# Altium project voltage_current_measurement.PrjPcb
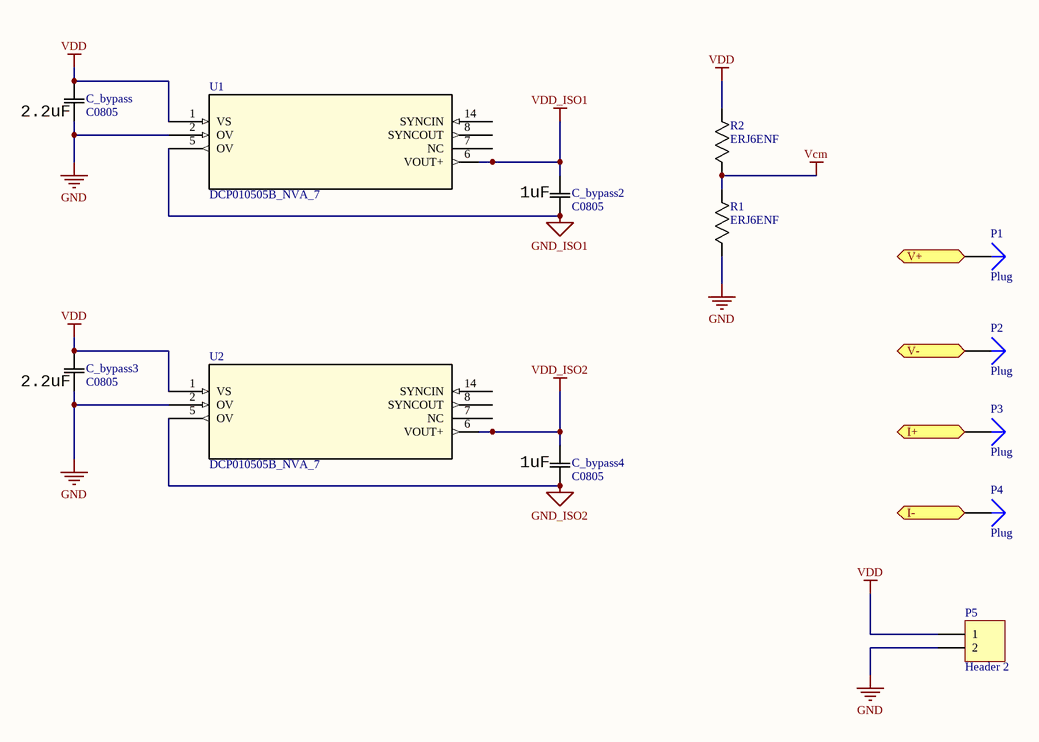
[diagram p0: Sheet1.SchDoc]
3 sheets, 36 parts. Net scope: flat (ports and power ports of the same name join across sheets).
Board file: PCB1.PcbDoc
Sheets:
  Sheet1.SchDoc
  Sheet2.SchDoc
  Sheet3.SchDoc

## Sheet Sheet1.SchDoc
size A4

### Parts
C_bypass  C0805  value 2.2uF  [C0805C]
C_bypass2  C0805  value 1uF  [C0805C]
C_bypass3  C0805  value 2.2uF  [C0805C]
C_bypass4  C0805  value 1uF  [C0805C]
P1  Plug  [PIN1]
P2  Plug  [PIN1]
P3  Plug  [PIN1]
P4  Plug  [PIN1]
P5  Header 2  [HDR1X2]
R1  ERJ6ENF  [0805]
R2  ERJ6ENF  [0805]
U1  DCP010505B_NVA_7  [NVA7]
U2  DCP010505B_NVA_7  [NVA7]

### Ports
I+ (bidir), I- (bidir), V+ (bidir), V- (bidir)

### Nets
GND: C_bypass.2 C_bypass3.2 P5.2 R1.1 U1.2(OV) U2.2(OV)
GND_ISO1: C_bypass2.2 U1.5(OV)
GND_ISO2: C_bypass4.2 U2.5(OV)
Vcm: R1.2 R2.1
VDD: C_bypass.1 C_bypass3.1 P5.1 R2.2 U1.1(VS) U2.1(VS)
VDD_ISO1: C_bypass2.1 U1.6(VOUT+)
VDD_ISO2: C_bypass4.1 U2.6(VOUT+)
NetC2_1: P4.1 ; port I-
NetP1_1: P1.1 ; port V+
NetP2_1: P2.1 ; port V-
NetP3_1: P3.1 ; port I+

Not connected (* = marked no-connect by the designer): U1 7(NC) 8(SYNCOUT) 14(SYNCIN); U2 7(NC) 8(SYNCOUT) 14(SYNCIN)

### Library data of the parts
C_bypass C_bypass2-C_bypass4 = C0805: Imported; Manufacturer_Part_Number: C0805C100C1GACTU; Vendor: Kemet; Built_By: EMA_UL_Team; C: Copyright (C) 2015 Accelerated Designs. All rights reserved; RefDes: RefDes; Type: DEV
P5 = Header 2: Header, 2-Pin; LatestRevisionDate: 17-Jul-2002; LatestRevisionNote: Re-released for DXP Platform.; Publisher: Altium Limited
R1 R2 = ERJ6ENF: Imported; Manufacturer_Part_Number: ERJ6ENF1000V; Vendor: Panasonic; Built_By: EMA_UL_Team; C: Copyright (C) 2016 Accelerated Designs. All rights reserved; RefDes: RefDes; Type: DEV; Value: Value
U1 U2 = DCP010505B_NVA_7: Imported; Manufacturer: Texas Instruments; Built_By: EMA_UL_Team; C: Copyright (C) 2015 Accelerated Designs. All rights reserved; Manufacturer_Part_Number: DCP010505B_NVA_7; Vendor: Texas Instruments; RefDes: RefDes; Type: DEV; Value: Value
P1-P4 = Plug: LatestRevisionDate: 17-Jul-2002; LatestRevisionNote: Re-released for DXP Platform.; Publisher: Altium Limited

## Sheet Sheet2.SchDoc
size A4
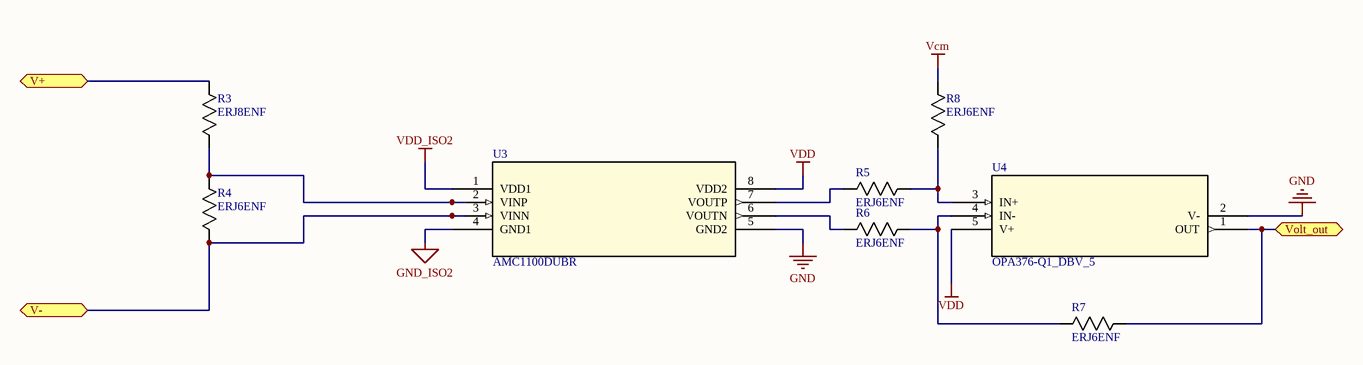
[diagram p1: Sheet2.SchDoc]

### Parts
R3  ERJ8ENF  [1206]
R4  ERJ6ENF  [0805]
R5  ERJ6ENF  [0805]
R6  ERJ6ENF  [0805]
R7  ERJ6ENF  [0805]
R8  ERJ6ENF  [0805]
U3  AMC1100DUBR  [DUB8]
U4  OPA376-Q1_DBV_5  [DBV5]

### Ports
V+ (bidir), V- (bidir), Volt_out (bidir)

### Nets
GND: U3.5(GND2) U4.2(V-)
GND_ISO2: U3.4(GND1)
Vcm: R8.2
VDD: U3.8(VDD2) U4.5(V+)
VDD_ISO2: U3.1(VDD1)
NetP1_1: R3.2 ; port V+
NetP2_1: R4.1 U3.3(VINN) ; port V-
NetR3_1: R3.1 R4.2 U3.2(VINP)
NetR5_1: R5.1 U3.7(VOUTP)
NetR5_2: R5.2 R8.1 U4.3(IN+)
NetR6_1: R6.1 U3.6(VOUTN)
NetR6_2: R6.2 R7.1 U4.4(IN-)
NetR7_2: R7.2 U4.1(OUT) ; port Volt_out

### Library data of the parts
R3 = ERJ8ENF: Imported; Manufacturer_Part_Number: ERJ8ENF1000V; Vendor: Panasonic; Built_By: EMA_UL_Team; C: Copyright (C) 2016 Accelerated Designs. All rights reserved; RefDes: RefDes; Type: DEV; Value: Value
R4-R8 = ERJ6ENF: as R1 on sheet Sheet1; RefDes: RefDes; Type: DEV; Value: Value
U3 = AMC1100DUBR: Imported; Vendor: Texas Instruments; Built_By: EMA_UL_Team; C: Copyright (C) 2015 Accelerated Designs. All rights reserved; Manufacturer_Part_Number: AMC1100DUBR; RefDes: RefDes; Type: DEV; Value: Value
U4 = OPA376-Q1_DBV_5: Imported; Manufacturer: Texas Instruments; Built_By: EMA_UL_Team; C: Copyright (C) 2015 Accelerated Designs. All rights reserved; Vendor: Texas Instruments; Manufacturer_Part_Number: OPA376-Q1_DBV_5; RefDes: RefDes; Type: DEV; Value: Value

## Sheet Sheet3.SchDoc
size A4
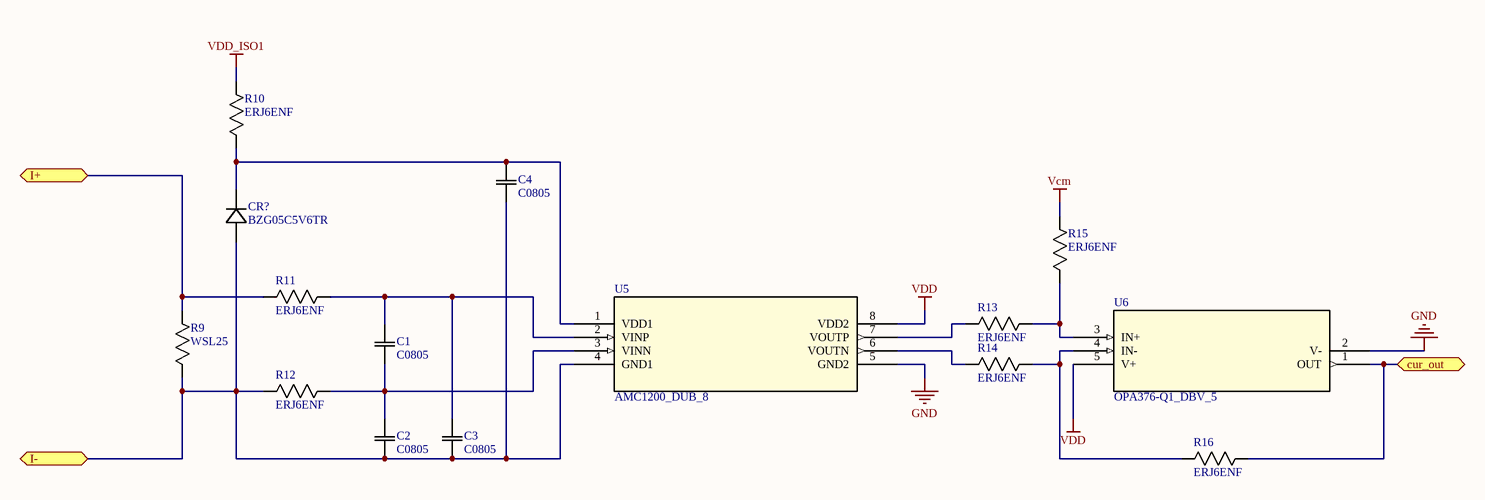
[diagram p2: Sheet3.SchDoc]

### Parts
C1  C0805  [C0805C]
C2  C0805  [C0805C]
C3  C0805  [C0805C]
C4  C0805  [C0805C]
CR?  BZG05C5V6TR  [DO-214AC]
R9  WSL25  [RES_2512_WSL]
R10  ERJ6ENF  [0805]
R11  ERJ6ENF  [0805]
R12  ERJ6ENF  [0805]
R13  ERJ6ENF  [0805]
R14  ERJ6ENF  [0805]
R15  ERJ6ENF  [0805]
R16  ERJ6ENF  [0805]
U5  AMC1200_DUB_8  [DUB8]
U6  OPA376-Q1_DBV_5  [DBV5]

### Ports
cur_out (bidir), I+ (bidir), I- (bidir)

### Nets
GND: U5.5(GND2) U6.2(V-)
Vcm: R15.2
VDD: U5.8(VDD2) U6.5(V+)
VDD_ISO1: R10.2
NetC1_1: C1.1 C2.2 R12.2 U5.3(VINN)
NetC1_2: C1.2 C3.2 R11.2 U5.2(VINP)
NetC2_1: C2.1 C3.1 C4.1 CR?.2 R9.2 R12.1 U5.4(GND1) ; port I-
NetC4_2: C4.2 CR?.1 R10.1 U5.1(VDD1)
NetP3_1: R9.1 R11.1 ; port I+
NetR13_1: R13.1 U5.7(VOUTP)
NetR13_2: R13.2 R15.1 U6.3(IN+)
NetR14_1: R14.1 U5.6(VOUTN)
NetR14_2: R14.2 R16.1 U6.4(IN-)
NetR16_2: R16.2 U6.1(OUT) ; port cur_out

### Library data of the parts
C1-C4 = C0805: Imported; Manufacturer_Part_Number: C0805C100C1GACTU; Vendor: Kemet; Built_By: EMA_UL_Team; Type: DEV; C: Copyright (C) 2015 Accelerated Designs. All rights reserved; RefDes: RefDes; Value: Value
CR? = BZG05C5V6TR: Imported; Vendor: Vishay; Built_By: EMA_UL_Team; Type: DEV; C: Copyright (C) 2015 Accelerated Designs. All rights reserved; Manufacturer_Part_Number: BZG05C5V6TR; RefDes: RefDes; Value: Value
R9 = WSL25: Imported; Manufacturer_Part_Number: WSL25121L000FEA; Vendor: Vishay; Built_By: EMA_UL_Team; C: Copyright (C) 2015 Accelerated Designs. All rights reserved; RefDes: RefDes; Type: DEV; Value: Value
R10-R16 = ERJ6ENF: as R1 on sheet Sheet1; RefDes: RefDes; Type: DEV; Value: Value
U5 = AMC1200_DUB_8: 4kV peak Isolated Amplifier for Current Shunt Measurements; Manufacturer: Texas Instruments; INDUSTRY_STD_PKG_TYPE: SOP; FAMILY_NAME: ISOLATED ADC; PIN_COUNT: 8; PACKAGE_DESIGNATOR: DUB; Datasheet_URL: http://www.ti.com/lit/gpn/AMC1200; GENERIC_PART_NUMBER: AMC1200; RefDes: RefDes; Type: DEV; Value: Value
U6 = OPA376-Q1_DBV_5: as U4 on sheet Sheet2; Vendor: Texas Instruments; Manufacturer_Part_Number: OPA376-Q1_DBV_5; RefDes: RefDes; Type: DEV; Value: Value

## Nets that join several sheets
GND: Sheet1 (6 pins), Sheet2 (U3.5 U4.2), Sheet3 (U5.5 U6.2)
GND_ISO2: Sheet1 (C_bypass4.2 U2.5), Sheet2 (U3.4)
Vcm: Sheet1 (R1.2 R2.1), Sheet2 (R8.2), Sheet3 (R15.2)
VDD: Sheet1 (6 pins), Sheet2 (U3.8 U4.5), Sheet3 (U5.8 U6.5)
VDD_ISO1: Sheet1 (C_bypass2.1 U1.6), Sheet3 (R10.2)
VDD_ISO2: Sheet1 (C_bypass4.1 U2.6), Sheet2 (U3.1)
NetC2_1: Sheet1 (P4.1), Sheet3 (7 pins)
NetP1_1: Sheet1 (P1.1), Sheet2 (R3.2)
NetP2_1: Sheet1 (P2.1), Sheet2 (R4.1 U3.3)
NetP3_1: Sheet1 (P3.1), Sheet3 (R9.1 R11.1)